# EAGLE design LCD_Interface Board_V1.0 (EAGLE 9.6.2)
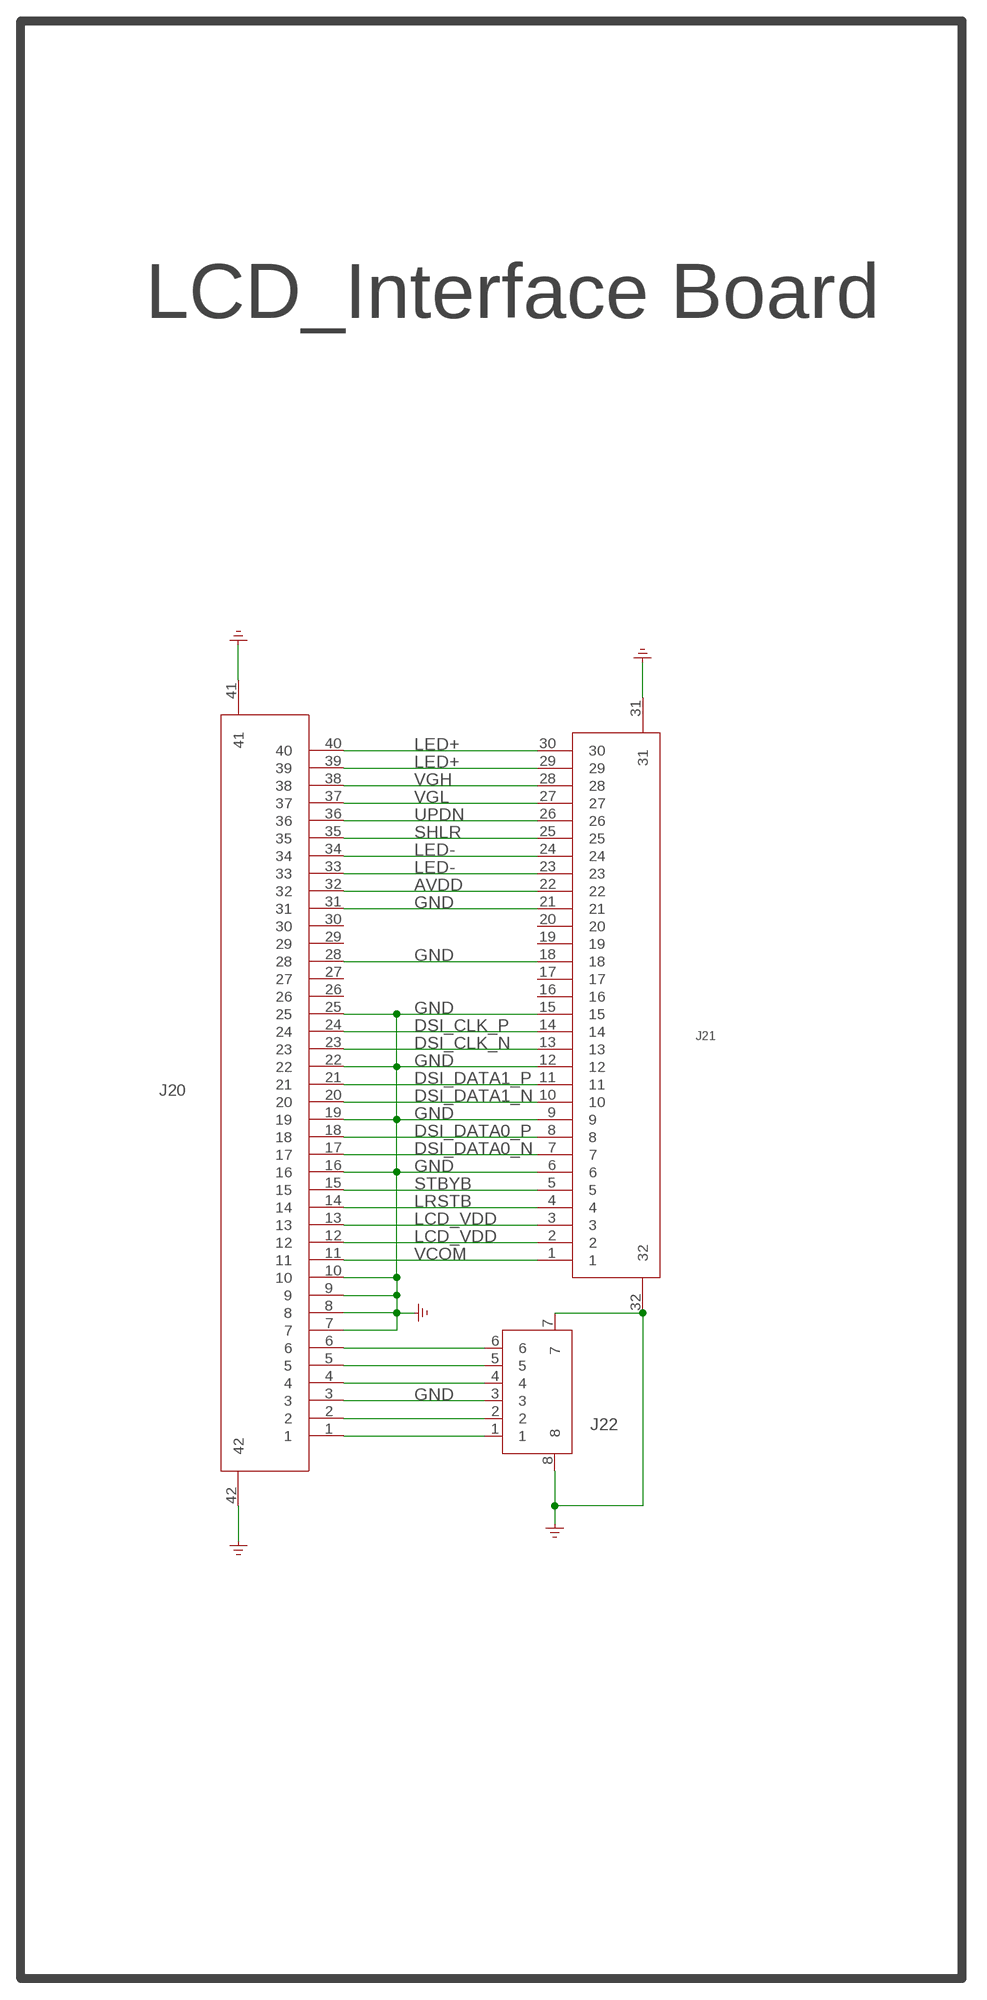
[diagram p0: schematic, sheet 1]

## Parts
J20  C19273935_40P_0.5MM_下接_HC-FPC-0.5-40P-FH20  [C19273935_40P_0.5MM_下接_HC-FPC-0.5-40P-FH20]
J21  C23398852_30P_0.5MM_下接_FC-05A30P11H20  [C23398852_30P_0.5MM_下接_FC-05A30P11H20]
J22  C2856814_6P_0.5MM_下接_FPC-05F-6PH15  [C2856814_6P_0.5MM_下接_FPC-05F-6PH15]

## Nets
AVDD: J20.32 J21.22
DSI_CLK_N: J20.23 J21.13
DSI_CLK_P: J20.24 J21.14
DSI_DATA0_N: J20.17 J21.7
DSI_DATA0_P: J20.18 J21.8
DSI_DATA1_N: J20.20 J21.10
DSI_DATA1_P: J20.21 J21.11
GND: J20.3 J20.7 J20.8 J20.9 J20.10 J20.16 J20.19 J20.22 J20.25 J20.28 J20.31 J20.41 J20.42 J21.6 J21.9 J21.12 J21.15 J21.18 J21.21 J21.31 J21.32 J22.3 J22.7 J22.8
LCD_VDD: J20.12 J20.13 J21.2 J21.3
LED+: J20.39 J20.40 J21.29 J21.30
LED-: J20.33 J20.34 J21.23 J21.24
LRSTB: J20.14 J21.4
N$12: J20.6 J22.6
N$15: J20.5 J22.5
N$16: J20.4 J22.4
N$18: J20.2 J22.2
N$19: J20.1 J22.1
SHLR: J20.35 J21.25
STBYB: J20.15 J21.5
UPDN: J20.36 J21.26
VCOM: J20.11 J21.1
VGH: J20.38 J21.28
VGL: J20.37 J21.27
Unconnected: J20.26 J20.27 J20.29 J20.30 J21.16 J21.17 J21.19 J21.20

## Notes on the sheet
- LCD_Interface Board

## Library data of the parts
J20 = FPC:C19273935_40P_0.5MM_下接_HC-FPC-0.5-40P-FH20
J21 = FPC:C23398852_30P_0.5MM_下接_FC-05A30P11H20
J22 = C2856814_FPC-05MM-6PIN:C2856814_6P_0.5MM_下接_FPC-05F-6PH15

## Net classes
0 default: width 0.152 mm, drill 0.3 mm, clearance 0.152 mm

## Board
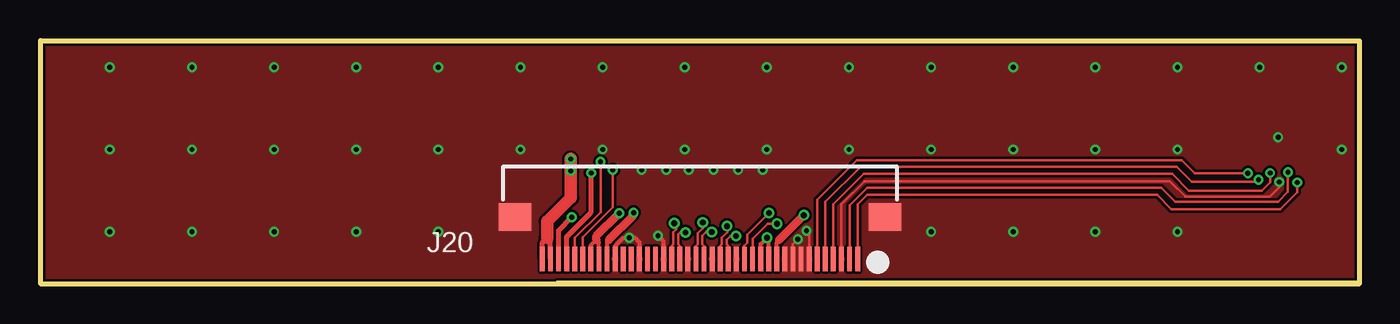
[diagram p1: board, top side]
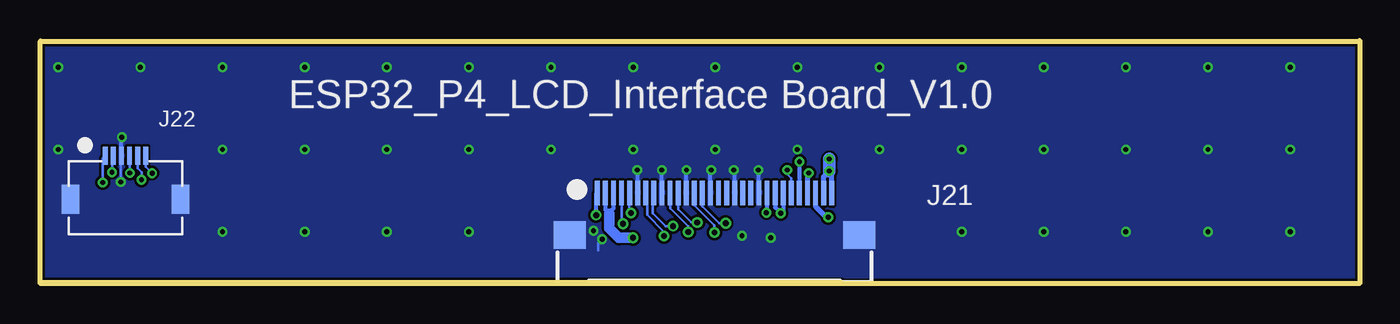
[diagram p2: board, bottom side, seen from below]

Size 81.6 x 15.04 mm. Coordinates in mm from the lower left corner, seen from the top.
Outline: 32,0.04 81.6,0.04
Outline: 0,15.04 0,15.03
Outline: 0,15 0,0 81.6,0 81.6,15 0,15
Copper layers (1*16): Top 0.035mm / dielectric 1.5mm / Bottom 0.035mm
Design rules "HMI_GZ": minimum track width 6mil, minimum drill 0.3mm, track to track 6mil, track to pad 6mil, pad to pad 6mil, via to via 6mil, smd to smd 6mil, copper to edge 6mil, drill to drill 4mil, minimum pad ring 6mil, minimum via ring 6mil, stop-mask expansion 4mil, vias tented up to drill 100mil, thermal gap 0mil

### Footprints (pad centres in the part's own frame; a part is rotated, then mirrored left to right if it is on the bottom)
C19273935_40P_0.5MM_下接_HC-FPC-0.5-40P-FH20 = smd 0.3 x 1.5: 1 -9.75,1.3; 2 -9.25,1.3; 3 -8.75,1.3; 4 -8.25,1.3; 5 -7.75,1.3; 6 -7.25,1.3; 7 -6.75,1.3; 8 -6.25,1.3; 9 -5.75,1.3; 10 -5.25,1.3; 11 -4.75,1.3; 12 -4.25,1.3; 13 -3.75,1.3; 14 -3.25,1.3; 15 -2.75,1.3; 16 -2.25,1.3; 17 -1.75,1.3; 18 -1.25,1.3; 19 -0.75,1.3; 20 -0.25,1.3; 21 0.25,1.3; 22 0.75,1.3; 23 1.25,1.3; 24 1.75,1.3; 25 2.25,1.3; 26 2.75,1.3; 27 3.25,1.3; 28 3.75,1.3; 29 4.25,1.3; 30 4.75,1.3; 31 5.25,1.3; 32 5.75,1.3; 33 6.25,1.3; 34 6.75,1.3; 35 7.25,1.3; 36 7.75,1.3; 37 8.25,1.3; 38 8.75,1.3; 39 9.25,1.3; 40 9.75,1.3 | smd 2 x 1.7: 41 11.45,-1.3; 42 -11.45,-1.3
C23398852_30P_0.5MM_下接_FC-05A30P11H20 = smd 0.3 x 1.5: 1 -7.25,1.3; 2 -6.75,1.3; 3 -6.25,1.3; 4 -5.75,1.3; 5 -5.25,1.3; 6 -4.75,1.3; 7 -4.25,1.3; 8 -3.75,1.3; 9 -3.25,1.3; 10 -2.75,1.3; 11 -2.25,1.3; 12 -1.75,1.3; 13 -1.25,1.3; 14 -0.75,1.3; 15 -0.25,1.3; 16 0.25,1.3; 17 0.75,1.3; 18 1.25,1.3; 19 1.75,1.3; 20 2.25,1.3; 21 2.75,1.3; 22 3.25,1.3; 23 3.75,1.3; 24 4.25,1.3; 25 4.75,1.3; 26 5.25,1.3; 27 5.75,1.3; 28 6.25,1.3; 29 6.75,1.3; 30 7.25,1.3 | smd 2 x 1.7: 31 8.95,-1.3; 32 -8.95,-1.3
C2856814_6P_0.5MM_下接_FPC-05F-6PH15 = smd 0.3 x 1.1: 1 -1.25,1.35; 2 -0.75,1.35; 3 -0.25,1.35; 4 0.25,1.35; 5 0.75,1.35; 6 1.25,1.35 | smd 1.1 x 1.8: 7 3.4,-1.35; 8 -3.4,-1.35

### Placement (x,y rotation side)
J20  40.8,2.82 180 top
J21  39.9,4.31 0 bottom
J22  76.34,6.56 0 bottom

### Tracks (layer width: path | path; a pad name or v marks a point on that pad's centre or on a via)
AVDD  (via drill 0.3 pad 0.6)
  Top 0.254: J20.32 35.05,2.6 35.16,2.7
  Top 0.508: 35.16,2.7 36.69,4.24 v36.69,4.39
  Bottom 0.254: v36.69,4.39 36.65,4.42 J21.22
DSI_CLK_N  (via drill 0.35)
  Top 0.152: J20.23 39.55,2.32 39.45,2.42 39.45,3.06 39.6,3.21 39.86,3.21 v39.91,3.16
  Bottom 0.152: v39.91,3.16 39.91,3.61 41.15,4.86 J21.13
DSI_CLK_P  (via drill 0.35 pad 0.55)
  Top 0.152: J20.24 39.05,2.32 39.15,2.42 39.15,3.19 39.32,3.36 39.32,3.62 v39.21,3.73
  Bottom 0.152: v39.21,3.73 39.6,3.73 40.65,4.78 J21.14
DSI_DATA0_N  (via drill 0.35)
  Top 0.152: J20.17 42.55,2.32 42.45,2.42 42.45,2.71 42.68,2.93 v43.03,2.93
  Bottom 0.152: v43.03,2.93 43.03,3.21 44.08,4.26 44.08,5.53 J21.7
DSI_DATA0_P  (via drill 0.35)
  Top 0.152: J20.18 42.05,2.32 42.15,2.42 42.15,2.84 42.48,3.17 v42.48,3.55
  Bottom 0.152: v42.48,3.55 42.93,3.55 43.72,4.34 43.72,5.54 J21.8
DSI_DATA1_N  (via drill 0.35)
  Top 0.152: J20.20 41.05,2.32 40.95,2.42 40.95,2.96 41.19,3.19 v41.53,3.19
  Bottom 0.152: v41.53,3.19 41.53,3.53 42.64,4.65 42.64,5.59 J21.10 | v41.53,3.19
DSI_DATA1_P  (via drill 0.35)
  Top 0.152: J20.21 40.55,2.32 40.65,2.42 40.65,3.1 40.97,3.42 v40.97,3.78
  Bottom 0.152: v40.97,3.78 41.34,3.78 42.15,4.6 J21.11
GND  (via drill 0.3 pad 0.6)
  Top 0.152: J20.9 46.55,2.44 v46.86,2.75 | J20.7 47.55,3.1 v47.39,3.26 | J20.3 49.55,4.91 50.99,6.34 69.87,6.34 70.84,5.37 76.05,5.37 76.64,5.96 v76.64,6.28
  Top 0.254: J20.31 35.55,2.34 36.05,2.83 v36.43,2.83 36.79,2.83 37.05,2.57 J20.28 | J20.25 38.55,2.61 v38.2,2.96
  Bottom 0.152: v46.86,2.75 47.09,2.51 47.09,2.07 | J22.3 76.64,7.86 v76.64,6.28
  Bottom 0.254: J21.18 38.65,6.96 v38.71,7.02 | J21.15 40.15,6.98 v40.11,7.02 | J21.21 37.15,6.99 v37.19,7.02 | J21.12 41.65,7 v41.63,7.02 | J21.9 v43.15,7.02 v43.16,7.02 | J21.6 44.65,6.99 v44.68,7.02 | J22.3 76.59,9.03 v76.56,9.05
  other vias: 14.46,13.37 14.46,8.29 14.46,3.21 19.54,13.37 19.54,8.29 19.54,3.21 24.62,3.21 24.62,8.29 24.62,13.37 29.7,13.37 29.7,8.29 34.78,8.29 34.78,13.37 39.86,13.37 39.86,8.29 44.94,8.29 44.94,13.37 50.02,13.37 50.02,8.29 55.1,13.37 55.1,8.29 55.1,3.21 60.18,8.29 60.18,13.37 60.18,3.21 65.26,13.37 70.34,13.37 75.42,13.37 80.5,13.37 65.26,8.29 65.26,3.21 70.34,8.29 70.34,3.21 80.5,8.29 9.38,3.21 4.3,3.21 4.3,8.29 9.38,8.29 9.38,13.37 4.3,13.37
  pour Top (rank 2): -0.99,-1.28 -0.99,15.01 0.2,16.2 114.82,16.2 115.42,15.6 115.42,-1.1 114.72,-1.8 -0.47,-1.8
  pour Bottom: -0.99,15.01 0.2,16.2 114.82,16.2 115.42,15.6 115.42,-1.1 114.72,-1.8 -0.47,-1.8 -0.99,-1.28
LCD_VDD  (via drill 0.35)
  Top 0.254: J20.13 44.55,2.45 v44.94,2.83 45.05,2.72 J20.12
  Bottom 0.254: J21.2 46.65,4.56 46.45,4.36 | 46.45,4.36 46.42,4.33 | J21.3 46.15,4.65 46.45,4.36
  Bottom 0.635: v44.94,2.83 45.82,2.83 46.42,3.42 46.42,4.33
LED+  (via drill 0.3 pad 0.6)
  Top 0.254: 31.41,2.77 31.35,2.83
  Top 0.305: J20.40 31.05,2.53 31.35,2.83 | J20.39 31.55,2.63 31.41,2.77
  Top 0.762: 31.35,2.83 31.35,3.85 32.81,5.31 v32.81,6.96 v32.8,6.96 v32.8,7.71
  Bottom 0.305: J21.30 32.65,6.81 v32.81,6.96 33.15,6.61 J21.29
  Bottom 0.762: v32.81,6.96 v32.8,6.96 v32.8,7.71
LED-  (via drill 0.3 pad 0.6)
  Top 0.254: J20.33 34.55,2.55 34.39,2.7 34.05,2.36 J20.34
  Top 0.508: 34.39,2.7 34.39,2.95 v35.8,4.36
  Bottom 0.254: J21.24 35.66,5.6 35.66,4.49 v35.8,4.36 36.15,4.71 J21.23
LRSTB  (via drill 0.35)
  Top 0.152: v45.55,3.7 44.98,3.7 44.05,2.77 J20.14
  Bottom 0.152: J21.4 45.65,3.8 v45.55,3.7
N$12  (via drill 0.3 pad 0.6)
  Top 0.152: J20.6 48.05,5.18 50.48,7.62 70.6,7.62 71.39,6.83 v74.69,6.83
  Bottom 0.152: J22.6 75.09,7.23 v74.69,6.83
N$15  (via drill 0.3 pad 0.6)
  Top 0.152: J20.5 48.55,5.05 50.73,7.23 70.29,7.23 71.22,6.3 75.22,6.3 v75.35,6.42
  Bottom 0.152: J22.5 75.59,7.14 75.35,6.9 v75.35,6.42
N$16  (via drill 0.3 pad 0.6)
  Top 0.152: J20.4 49.05,4.91 50.92,6.78 70.01,6.78 71.04,5.75 75.55,5.75 76.06,6.26 v76.06,6.84
  Bottom 0.152: J22.4 76.06,7.89 v76.06,6.84
N$18  (via drill 0.3 pad 0.6)
  Top 0.152: J20.2 50.05,4.85 51.13,5.94 69.34,5.94 70.21,5.07 76.56,5.07 77.17,5.68 v77.17,6.89
  Bottom 0.152: J22.2 77.17,7.83 v77.17,6.89
N$19  (via drill 0.3 pad 0.6)
  Top 0.152: J20.1 50.56,1.53 50.56,4.9 51.15,5.49 69.07,5.49 69.95,4.61 76.7,4.61 77.75,5.66 v77.75,6.26
  Bottom 0.152: v77.75,6.26 77.75,7.75 J22.1
SHLR  (via drill 0.3 pad 0.6)
  Top 0.152: J20.35 33.55,2.88 35.41,4.73 v35.41,7.02
  Bottom 0.152: J21.25 35.15,6.52 35.4,6.77 v35.4,7.02 v35.41,7.02
STBYB  (via drill 0.35)
  Top 0.152: J20.15 43.55,2.33 43.74,2.52 43.74,3.03 v45.08,4.37
  Bottom 0.152: J21.5 45.14,5.59 45.19,5.54 45.19,4.48 v45.08,4.37
UPDN  (via drill 0.3 pad 0.6)
  Top 0.152: J20.36 33.05,2.83 34.65,4.42 v34.65,7.53
  Bottom 0.254: v34.65,7.53 J21.26
VCOM  (via drill 0.35)
  Top 0.254: J20.11 45.55,2.56 45.7,2.7
  Top 0.508: v47.22,4.23 45.7,2.7
  Bottom 0.254: v47.22,4.23 47.22,5.54 J21.1
VGH  (via drill 0.3 pad 0.6)
  Top 0.305: J20.38 32.05,3.28 v32.87,4.1
  Bottom 0.305: J21.28 33.64,5.6 33.64,4.77 32.98,4.1 v32.87,4.1
VGL  (via drill 0.3 pad 0.6)
  Top 0.305: J20.37 32.55,2.89 34.07,4.41 v34.07,6.84
  Bottom 0.305: v34.07,6.84 34.04,6.81 34.04,6.64 34.15,6.53 J21.27

### Text on the board
bPlace: ESP32_P4_LCD_Interface Board_V1.0